# Altium schematic sheet usbpd_input.SchDoc: USB-PD
size A4; Organization: GPA Robotics; DocumentNumber: 5; Revision: REV 0; SheetNumber: 5; SheetTotal: 11
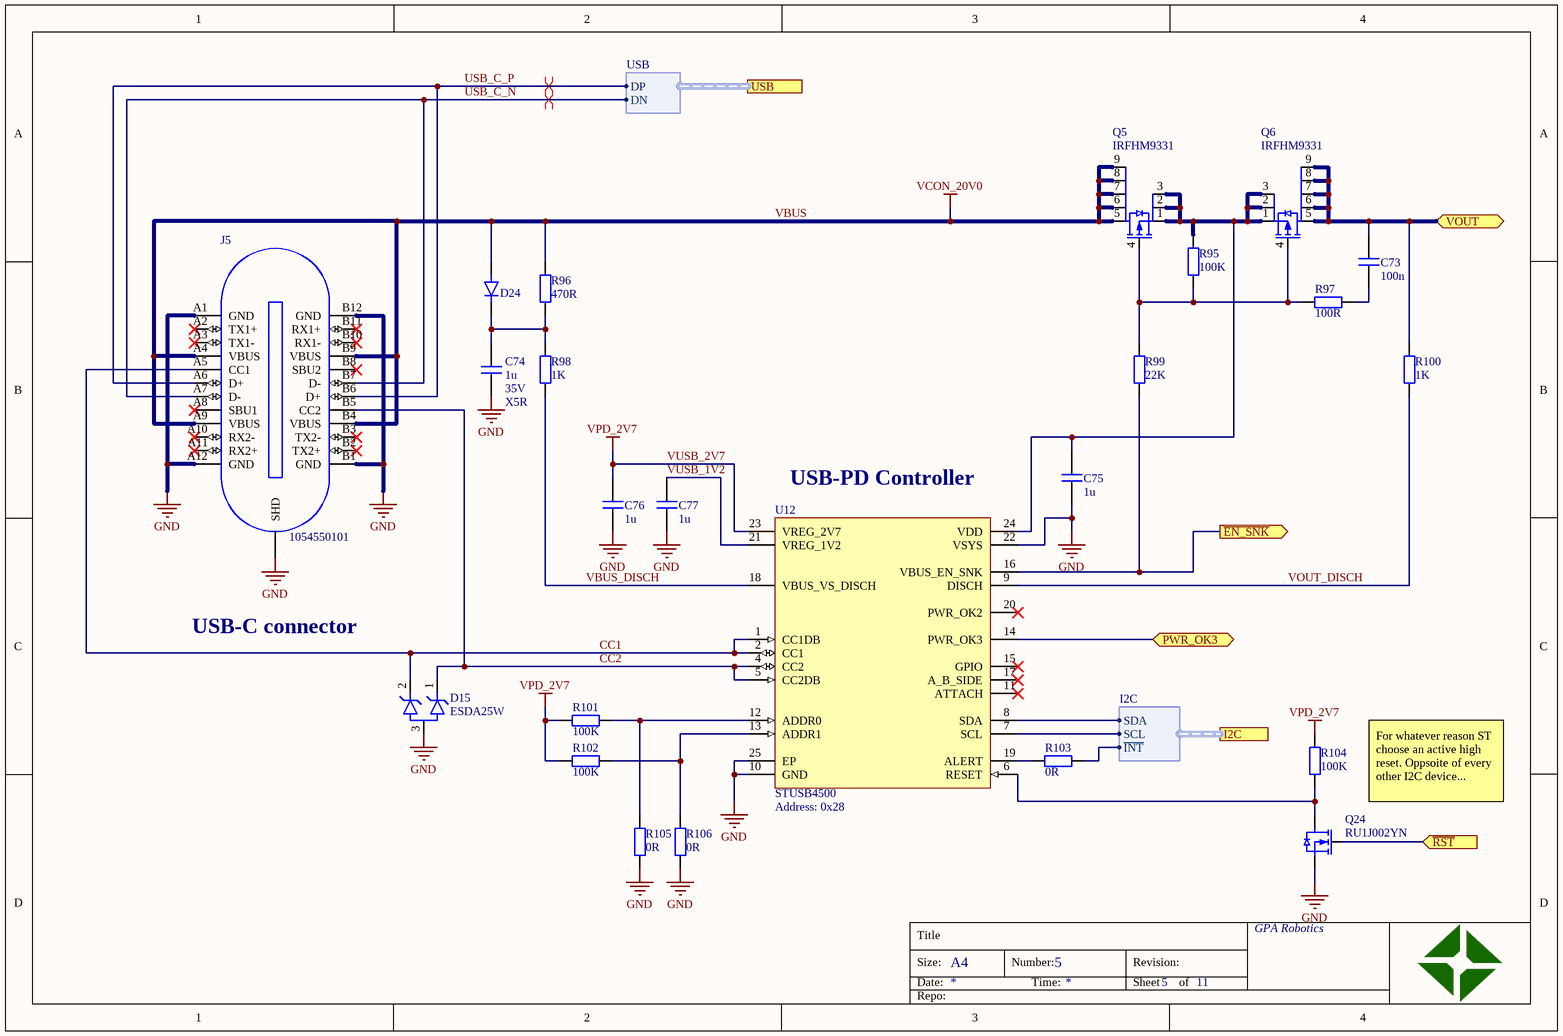
[diagram p0: usbpd_input.SchDoc]

## Parts
C73  value 100n  [CAPC1005X06N]  (hidden comment: cap)
C74  value 1u  voltage: 35V  type: X5R  [CAPC2012X11N]  (hidden comment: cap)
C75  value 1u  [CAPC2012X11N]  (hidden comment: cap)
C76  value 1u  [CAPC2012X11N]  (hidden comment: cap)
C77  value 1u  [CAPC2012X11N]  (hidden comment: cap)
D15  ESDA25W  [SOT65P210X110-3N_SOT323-3L]
D24  DFLS2100  [SODFL370X100-2N_DFLS2100]  (value not drawn)
J5  1054550101  [1054550101]
Q5  IRFHM9331  [PQFN67P300X300X100-8N]
Q6  IRFHM9331  [PQFN67P300X300X100-8N]
Q24  RU1J002YN  [SOTFL65P210X105-3N]
R95  value 100K  [RESC1005X04N]  (hidden comment: res)
R96  value 470R  [RESC2012X06N]  (hidden comment: res)
R97  value 100R  [RESC1005X04N]  (hidden comment: res)
R98  value 1K  [RESC2012X06N]  (hidden comment: res)
R99  value 22K  [RESC1005X04N]  (hidden comment: res)
R100  value 1K  [RESC1005X04N]  (hidden comment: res)
R101  value 100K  [RESC1005X04N]  (hidden comment: res)
R102  value 100K  [RESC1005X04N]  (hidden comment: res)
R103  value 0R  [RESC1005X04N]  (hidden comment: res)
R104  value 100K  [RESC1005X04N]  (hidden comment: res)
R105  value 0R  [RESC1005X04N]  (hidden comment: res)
R106  value 0R  [RESC1005X04N]  (hidden comment: res)
U12  STUSB4500  Address: 0x28  [QFN50P400X400X100_HS-25N-STUSB4500]

## Ports
I2C (harness I2C), PWR_OK3 (bidir), USB (harness USB), VOUT (bidir), ~{EN_SNK} (out), ~{RST} (in)

## Harnesses
I2C: SDA, SCL, ~{INT}
USB: DP, DN

## Nets
GND: C74.1 C75.1 C76.1 C77.1 D15.3 J5.A1(GND) J5.A12(GND) J5.B1(GND) J5.B12(GND) J5.SHD Q24.2(S) R105.1 R106.1 U12.10(GND) U12.22(VSYS) U12.25(EP)
VBUS: D24.A J5.A4(VBUS) J5.A9(VBUS) J5.B4(VBUS) J5.B9(VBUS) Q5.5(D) Q5.6(D) Q5.7(D) Q5.8(D) Q5.9(D) R96.2  [also labelled VCON_20V0]
VUSB_2V7: C76.2 R101.1 R102.1 R104.2 U12.23(VREG_2V7)  [also labelled VPD_2V7]
~{EN_SNK}: R99.1 U12.16(VBUS_EN_SNK) ; port ~{EN_SNK}
~{RST}: Q24.1(G) ; port ~{RST}
CC1: D15.2 J5.A5(CC1) U12.1(CC1DB) U12.2(CC1)
CC2: D15.1 J5.B5(CC2) U12.4(CC2) U12.5(CC2DB)
PWR_OK3: U12.14(PWR_OK3) ; port PWR_OK3
USB_C_N: J5.A7(D-) J5.B7(D-) ; port USB.DN
USB_C_P: J5.A6(D+) J5.B6(D+) ; port USB.DP
VBUS_DISCH: R98.1 U12.18(VBUS_VS_DISCH)
VOUT: C73.2 Q6.5(D) Q6.6(D) Q6.7(D) Q6.8(D) Q6.9(D) R100.2 ; port VOUT
VOUT_DISCH: R100.1 U12.9(DISCH)
VUSB_1V2: C77.2 U12.21(VREG_1V2)
NetC73_1: C73.1 R97.2
NetC74_2: C74.2 D24.C R96.1 R98.2
NetC75_2: C75.2 Q5.1(S) Q5.2(S) Q5.3(S) Q6.1(S) Q6.2(S) Q6.3(S) R95.2 U12.24(VDD)
NetQ5_4: Q5.4(G) Q6.4(G) R95.1 R97.1 R99.2
NetQ24_3: Q24.3(D) R104.1 U12.6(RESET)
NetR101_2: R101.2 R105.2 U12.12(ADDR0)
NetR102_2: R102.2 R106.2 U12.13(ADDR1)
NetR103_1: R103.1 U12.19(ALERT)
NetR103_2: R103.2 ; port I2C.~{INT}
NetU12_7: U12.7(SCL) ; port I2C.SCL
NetU12_8: U12.8(SDA) ; port I2C.SDA

Not connected (* = marked no-connect by the designer): J5 A2(TX1+)* A3(TX1-)* A8(SBU1)* A10(RX2-)* A11(RX2+)* B2(TX2+)* B3(TX2-)* B8(SBU2)* B10(RX1-)* B11(RX1+)*; U12 11(ATTACH)* 15(GPIO)* 17(A_B_SIDE)* 20(PWR_OK2)*

## Layout directives
differential pair: USB_C_N, USB_C_P

## Notes on the sheet
- (near U12) USB-PD Controller
- USB-C connector
- For whatever reason ST choose an active high reset. Oppsoite of every other I2C device...
- Title
- Size:
- Date:
- A4
- Number:
- Time:
- Revision:
- Sheet
- of
- Repo:

## Library data of the parts
C73-C77 = cap: Capacitor; #digikey: *; #mouser: *
  C73 C75-C77: voltage: *; type: *
D15 = esda25w: TRANSIL array for data protection; ComponentLink1Description: datasheet; ComponentLink1URL: https://www.st.com/content/ccc/resource/technical/document/datasheet/cd/9b/8d/39/1f/d4/43/ba/CD00064033.pdf/files/CD00064033.pdf/jcr:content/translations/en.CD00064033.pdf
D24 = dfls2100: 2.0A HIGH VOLTAGE SCHOTTKY BARRIER RECTIFIER; ComponentLink1Description: datasheet; ComponentLink1URL: https://www.diodes.com/assets/Datasheets/ds31475.pdf
J5 = 1054550101: USB TYPE C REC MIDDLE MOUNT TYPE; ComponentLink1Description: drawing; ComponentLink1URL: https://www.molex.com/pdm_docs/sd/1054550101_sd.pdf
Q5 Q6 = irfhm9331: HEXFET Power MOSFET; ComponentLink1Description: datasheet; ComponentLink1URL: https://www.infineon.com/dgdl/irfhm9331pbf.pdf?fileId=5546d462533600a4015356237f7e1f59
Q24 = ru1j002yn: N-channel 50V 200mA Small signal MOSFET; ComponentLink1Description: datasheet; ComponentLink1URL: https://www.mouser.se/datasheet/2/348/ru1j002yn-e-1018335.pdf
R95-R106 = res: Resistor; power: *; voltage: *; #digikey: *; #mouser: *
U12 = stusb4500qtr: Standalone USB PD sink controller with short-to-VBUS protections; ComponentLink1Description: datasheet; ComponentLink1URL: https://www.st.com/resource/en/datasheet/stusb4500.pdf